# EAGLE design portal2 (EAGLE 5.10)
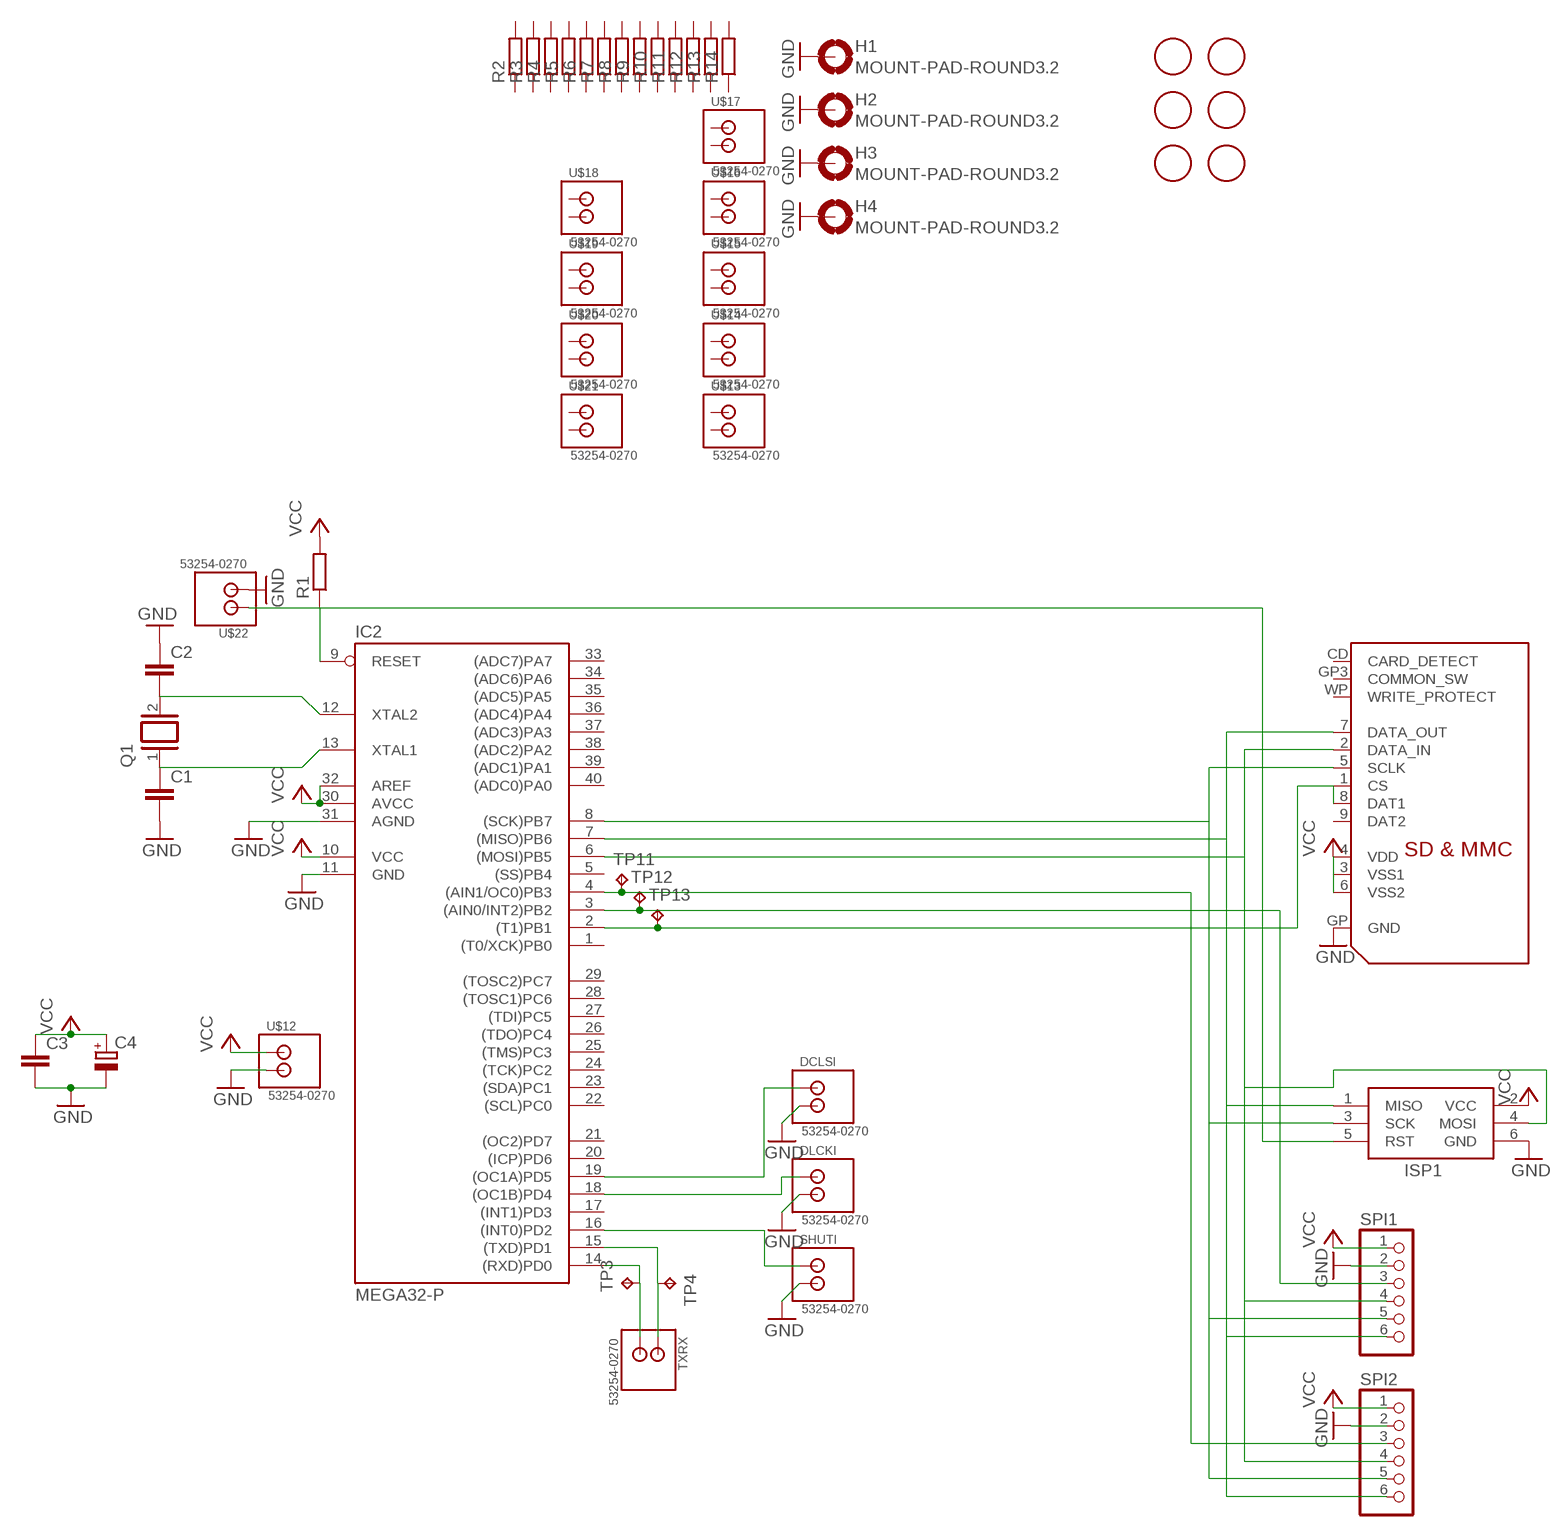
[diagram p0: schematic, sheet 1]

## Parts
C1  C-EU025-025X050  [C025-025X050]
C2  C-EU025-025X050  [C025-025X050]
C3  C-EU025-025X050  [C025-025X050]
C4  CPOL-EUE2,5-6E  [E2,5-6E]
DCLSI  53254-0270  [53254-0270]
DLCKI  53254-0270  [53254-0270]
H1  MOUNT-PAD-ROUND3.2  [3,2-PAD]
H2  MOUNT-PAD-ROUND3.2  [3,2-PAD]
H3  MOUNT-PAD-ROUND3.2  [3,2-PAD]
H4  MOUNT-PAD-ROUND3.2  [3,2-PAD]
IC2  MEGA32-P  [DIL40]
ISP1  AVRISP-6  [AVRISP]
Q1  XTAL/S  [QS]
R1  R-EU_0207/10  [0207/10]
R2  R-EU_0207/10  [0207/10]
R3  R-EU_0207/10  [0207/10]
R4  R-EU_0207/10  [0207/10]
R5  R-EU_0207/10  [0207/10]
R6  R-EU_0207/10  [0207/10]
R7  R-EU_0207/10  [0207/10]
R8  R-EU_0207/10  [0207/10]
R9  R-EU_0207/10  [0207/10]
R10  R-EU_0207/10  [0207/10]
R11  R-EU_0207/10  [0207/10]
R12  R-EU_0207/10  [0207/10]
R13  R-EU_0207/10  [0207/10]
R14  R-EU_0207/10  [0207/10]
SHUTI  53254-0270  [53254-0270]
SPI1  PINHD-1X6  [1X06]
SPI2  PINHD-1X6  [1X06]
TP3  TPB1,27  [B1,27]
TP4  TPB1,27  [B1,27]
TP11  TPB1,27  [B1,27]
TP12  TPB1,27  [B1,27]
TP13  TPB1,27  [B1,27]
TXRX  53254-0270  [53254-0270]
U$1  SDMMC06132  [06132]
U$2  FIDUCIAL  [FIDUCIAL_1MM]
U$3  FIDUCIAL  [FIDUCIAL_1MM]
U$4  FIDUCIAL  [FIDUCIAL_1MM]
U$5  FIDUCIAL  [FIDUCIAL_1MM]
U$6  FIDUCIAL  [FIDUCIAL_1MM]
U$7  FIDUCIAL  [FIDUCIAL_1MM]
U$12  53254-0270  [53254-0270]
U$13  53254-0270  [53254-0270]
U$14  53254-0270  [53254-0270]
U$15  53254-0270  [53254-0270]
U$16  53254-0270  [53254-0270]
U$17  53254-0270  [53254-0270]
U$18  53254-0270  [53254-0270]
U$19  53254-0270  [53254-0270]
U$20  53254-0270  [53254-0270]
U$21  53254-0270  [53254-0270]
U$22  53254-0270  [53254-0270]

## Nets
GND: C1.2 C2.1 C3.2 C4.- DCLSI.P$2 DLCKI.P$2 H1.B3,2(MOUNT) H2.B3,2(MOUNT) H3.B3,2(MOUNT) H4.B3,2(MOUNT) IC2.11(GND) IC2.31(AGND) ISP1.6(GND) SHUTI.P$2 SPI1.2 SPI2.2 U$1.GP(GND) U$12.P$2 U$22.P$2
N$1: C1.1 IC2.13(XTAL1) Q1.1
N$2: C2.2 IC2.12(XTAL2) Q1.2
N$3: IC2.8((SCK)PB7) ISP1.3(SCK) SPI1.5 SPI2.5 U$1.5(SCLK)
N$4: IC2.15((TXD)PD1) TP4.TP TXRX.P$1
N$5: IC2.14((RXD)PD0) TP3.TP TXRX.P$2
N$6: IC2.7((MISO)PB6) ISP1.1(MISO) SPI1.6 SPI2.6 U$1.7(DATA_OUT)
N$7: IC2.16((INT0)PD2) SHUTI.P$1
N$8: DLCKI.P$1 IC2.18((OC1B)PD4)
N$9: IC2.6((MOSI)PB5) ISP1.4(MOSI) SPI1.4 SPI2.4 U$1.2(DATA_IN)
N$10: DCLSI.P$1 IC2.19((OC1A)PD5)
N$14: IC2.4((AIN1/OC0)PB3) SPI2.3 TP11.TP
N$15: IC2.3((AIN0/INT2)PB2) SPI1.3 TP12.TP
N$16: IC2.2((T1)PB1) TP13.TP U$1.1(CS) U$1.8(DAT1)
RESET: IC2.9(RESET) ISP1.5(RST) R1.1 U$22.P$1
VCC: C3.1 C4.+ IC2.10(VCC) IC2.30(AVCC) IC2.32(AREF) ISP1.2(VCC) R1.2 SPI1.1 SPI2.1 U$1.4(VDD) U$1.6(VSS2) U$12.P$1
Unconnected: IC2.1((T0/XCK)PB0) IC2.5((SS)PB4) IC2.17((INT1)PD3) IC2.20((ICP)PD6) IC2.21((OC2)PD7) IC2.22((SCL)PC0) IC2.23((SDA)PC1) IC2.24((TCK)PC2) IC2.25((TMS)PC3) IC2.26((TDO)PC4) IC2.27((TDI)PC5) IC2.28((TOSC1)PC6) IC2.29((TOSC2)PC7) IC2.33((ADC7)PA7) IC2.34((ADC6)PA6) IC2.35((ADC5)PA5) IC2.36((ADC4)PA4) IC2.37((ADC3)PA3) IC2.38((ADC2)PA2) IC2.39((ADC1)PA1) IC2.40((ADC0)PA0) R2.1 R2.2 R3.1 R3.2 R4.1 R4.2 R5.1 R5.2 R6.1 R6.2 R7.1 R7.2 R8.1 R8.2 R9.1 R9.2 R10.1 R10.2 R11.1 R11.2 R12.1 R12.2 R13.1 R13.2 R14.1 R14.2 U$1.3(VSS1) U$1.9(DAT2) U$1.CD(CARD_DETECT) U$1.GP3(COMMON_SW) U$1.WP(WRITE_PROTECT) U$13.P$1 U$13.P$2 U$14.P$1 U$14.P$2 U$15.P$1 U$15.P$2 U$16.P$1 U$16.P$2 U$17.P$1 U$17.P$2 U$18.P$1 U$18.P$2 U$19.P$1 U$19.P$2 U$20.P$1 U$20.P$2 U$21.P$1 U$21.P$2

## Library data of the parts
C1-C3 = rcl:C-EU: CAPACITOR, European symbol
C4 = rcl:CPOL-EU: POLARIZED CAPACITOR, European symbol
DCLSI DLCKI SHUTI TXRX U$12-U$22 = shack1:53254-0270
H1-H4 = holes:MOUNT-PAD-ROUND: MOUNTING PAD, round
IC2 = avr:MEGA32-P: MICROCONTROLLER 32 Kbytes FLASH 2 Kbytes SRAM 1 Kbytes EEPROM USART 8-channel 10 bit ADC
ISP1 = adafruit:AVRISP: AVR ISP HEADER Standard 6 pin header for AVR programming
Q1 = special:XTAL/S: CRYSTAL
R1-R14 = rcl:R-EU_: RESISTOR, European symbol
SPI1 SPI2 = adafruit:PINHD-1X6: PIN HEADER
TP3 TP4 TP11-TP13 = testpad:TP: Test pad
U$1 = adafruit:SDMMC: SD MMC Card holder 4UCON part #06132 - easy to solder
U$2-U$7 = adafruit:FIDUCIAL: For use by pick and place machines to calibrate the vision/machine, 1mm By microbuilder.eu

## Board
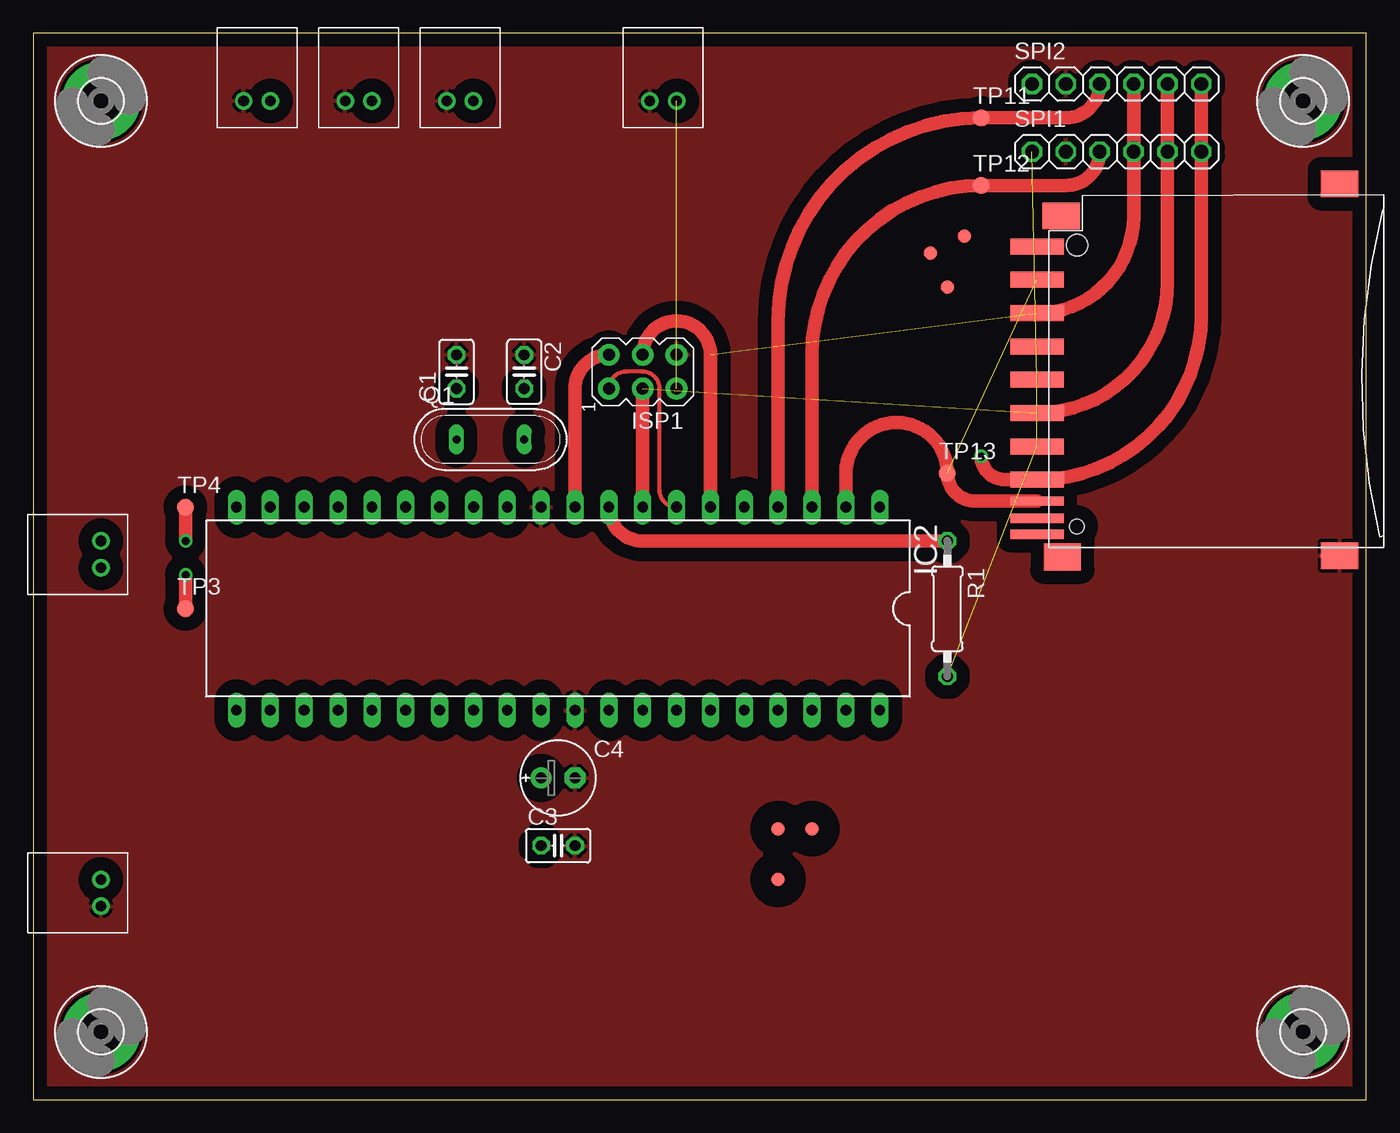
[diagram p1: board, top side]
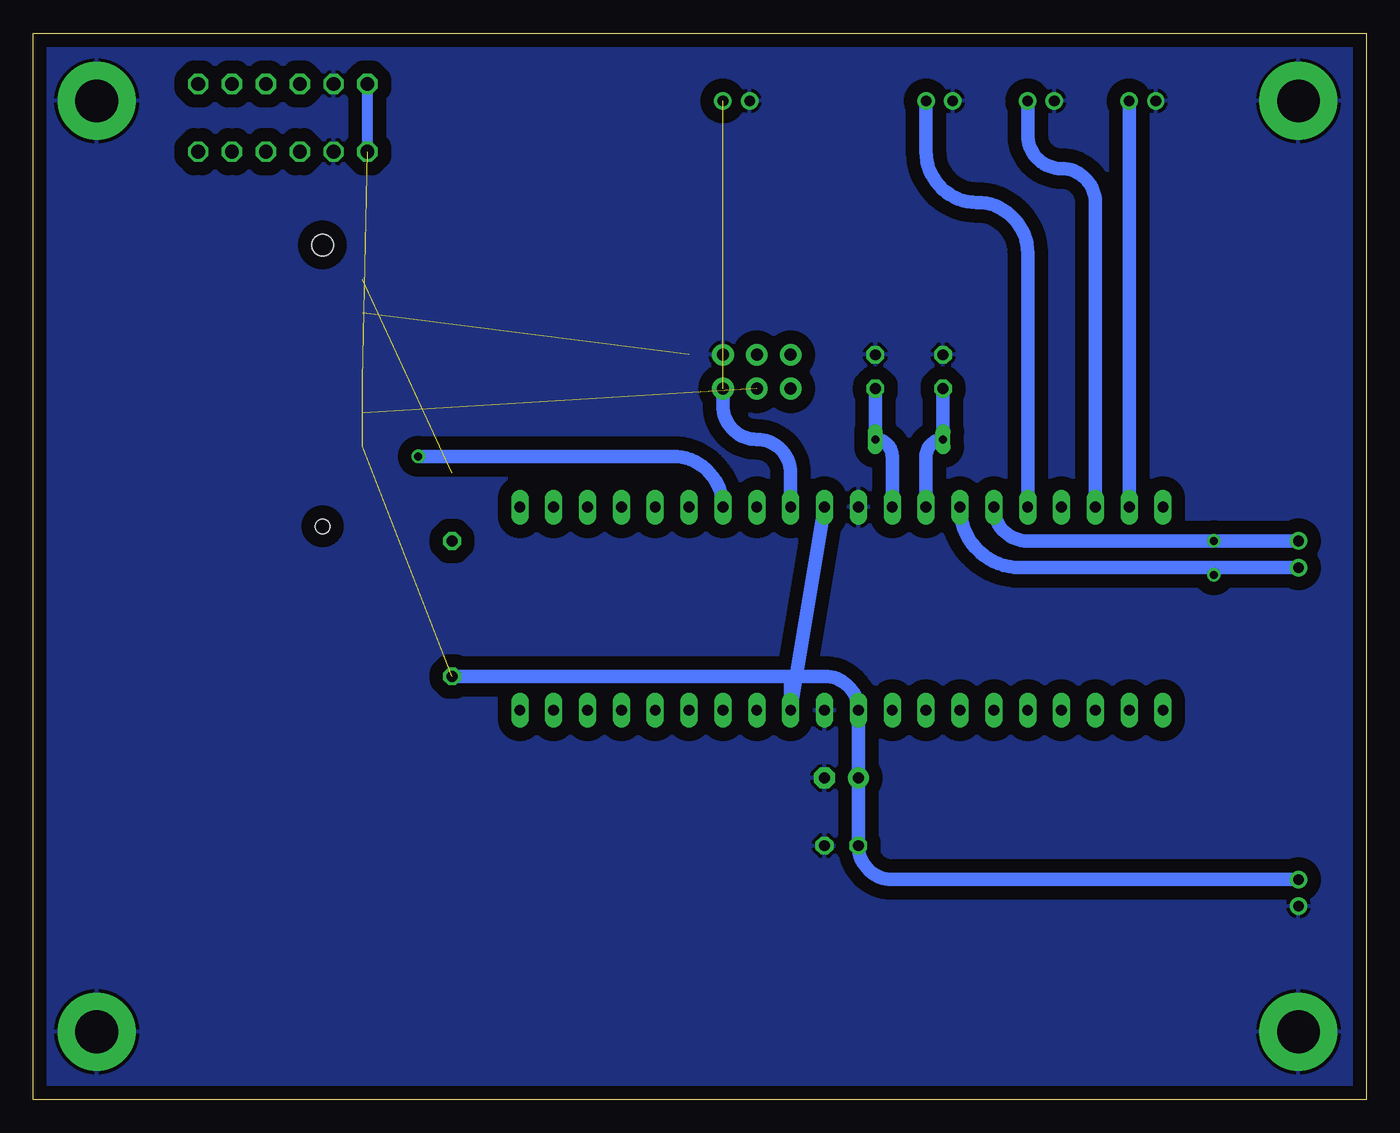
[diagram p2: board, bottom side, seen from below]

Size 100 x 80 mm. Coordinates in mm from the lower left corner, seen from the top.
Outline: 0,0 100,0 100,80 0,80 0,0
Copper layers (1*16): Top 0.035mm / dielectric 1.5mm / Bottom 0.035mm
Design rules "default": minimum track width 10mil, minimum drill 24mil, track to track 8mil, track to pad 8mil, pad to pad 8mil, via to via 8mil, smd to smd 8mil, copper to edge 40mil, drill to drill 8mil, minimum pad ring 10mil, minimum via ring 8mil, stop-mask expansion 4mil, vias tented up to drill 0mil, thermal gap 10mil

### Footprints (pad centres in the part's own frame; a part is rotated, then mirrored left to right if it is on the bottom)
C025-025X050 = drill 0.813 octagon: 1 -1.27,0; 2 1.27,0
E2,5-6E = drill 0.813 pad 1.575 round: + -1.27,0 | drill 0.813 pad 1.575 octagon: - 1.27,0
53254-0270 = drill 0.8 round: P$1 0,0; P$2 0,2
3,2-PAD = drill 3.2 pad 5.842 round: B3,2 0,0
DIL40 = drill 0.813 long: 1 -24.13,-7.62; 2 -21.59,-7.62; 3 -19.05,-7.62; 4 -16.51,-7.62; 5 -13.97,-7.62; 6 -11.43,-7.62; 7 -8.89,-7.62; 8 -6.35,-7.62; 9 -3.81,-7.62; 10 -1.27,-7.62; 11 1.27,-7.62; 12 3.81,-7.62; 13 6.35,-7.62; 14 8.89,-7.62; 15 11.43,-7.62; 16 13.97,-7.62; 17 16.51,-7.62; 18 19.05,-7.62; 19 21.59,-7.62; 20 24.13,-7.62; 21 24.13,7.62; 22 21.59,7.62; 23 19.05,7.62; 24 16.51,7.62; 25 13.97,7.62; 26 11.43,7.62; 27 8.89,7.62; 28 6.35,7.62; 29 3.81,7.62; 30 1.27,7.62; 31 -1.27,7.62; 32 -3.81,7.62; 33 -6.35,7.62; 34 -8.89,7.62; 35 -11.43,7.62; 36 -13.97,7.62; 37 -16.51,7.62; 38 -19.05,7.62; 39 -21.59,7.62; 40 -24.13,7.62
AVRISP = drill 0.9 pad 1.626 round: 1 -1.27,2.54; 2 1.27,2.54; 3 -1.27,0; 4 1.27,0; 5 -1.27,-2.54; 6 1.27,-2.54
QS = drill 0.61 long: 1 -2.54,0; 2 2.54,0
0207/10 = drill 0.813 octagon: 1 -5.08,0; 2 5.08,0
1X06 = drill 1.016 octagon: 1 -6.35,0; 2 -3.81,0; 3 -1.27,0; 4 1.27,0; 5 3.81,0; 6 6.35,0
B1,27 = smd 1.27 x 1.27: TP 0,0
06132 = smd 1.2 x 4: 1 6.9,0.9; 2 4.4,0.9; 3 1.9,0.9; 4 -0.6,0.9; 5 -3.1,0.9; 6 -5.6,0.9; 7 -8.1,0.9; 9 9.4,0.9 | smd 0.7 x 4: 8 -9.7,0.9; CD -11,0.9; WP -12.2,0.9 | smd 2 x 2.8: GP -13.8,-21.8; GP2 14.1,-21.8; GP3 11.7,-0.9; GP4 -13.9,-1 | hole 1.1: -11.6,-2.1 | hole 1.6: 9.5,-2.1
FIDUCIAL_1MM = smd 1 x 1: 1 0,0

### Placement (x,y rotation side)
C1  31.75,54.61 90 top
C2  36.83,54.61 270 top
C3  39.37,19.05 0 top
C4  39.37,24.13 0 top
DCLSI  17.78,74.93 90 top
DLCKI  25.4,74.93 90 top
H1  95.25,5.08 0 top
H2  95.25,74.93 0 top
H3  5.08,74.93 0 top
H4  5.08,5.08 0 top
IC2  39.37,36.83 180 top
ISP1  45.72,54.61 90 top
Q1  34.29,49.53 0 top
R1  68.58,36.83 270 top
R2  -68.58,99.06 0 top  (outside the outline)
R3  -81.28,99.06 0 top  (outside the outline)
R4  -19.05,104.14 0 top  (outside the outline)
R5  -31.75,104.14 0 top  (outside the outline)
R6  -44.45,104.14 0 top  (outside the outline)
R7  -57.15,104.14 0 top  (outside the outline)
R8  -69.85,104.14 0 top  (outside the outline)
R9  -82.55,104.14 0 top  (outside the outline)
R10  -19.05,109.22 0 top  (outside the outline)
R11  -31.75,109.22 0 top  (outside the outline)
R12  -44.45,109.22 0 top  (outside the outline)
R13  -57.15,109.22 0 top  (outside the outline)
R14  -69.85,109.22 0 top  (outside the outline)
SHUTI  33.02,74.93 90 top
SPI1  81.28,71.12 0 top
SPI2  81.28,76.2 0 top
TP3  11.43,36.83 0 top
TP4  11.43,44.45 0 top
TP11  71.12,73.66 0 top
TP12  71.12,68.58 0 top
TP13  68.58,46.99 0 top
TXRX  5.08,41.91 180 top
U$1  76.2,54.61 90 top
U$2  58.42,20.32 0 top
U$3  55.88,20.32 0 top
U$4  55.88,16.51 0 top
U$5  68.58,60.96 0 top
U$6  67.31,63.5 0 top
U$7  69.85,64.77 0 top
U$12  5.08,16.51 180 top
U$13  -86.36,-43.18 0 top  (outside the outline)
U$14  -86.36,-50.8 0 top  (outside the outline)
U$15  -86.36,-58.42 0 top  (outside the outline)
U$16  -86.36,-66.04 0 top  (outside the outline)
U$17  -86.36,-73.66 0 top  (outside the outline)
U$18  -86.36,-81.28 0 top  (outside the outline)
U$19  -86.36,-88.9 0 top  (outside the outline)
U$20  -86.36,-96.52 0 top  (outside the outline)
U$21  -86.36,-104.14 0 top  (outside the outline)
U$22  48.26,74.93 90 top

### Tracks (layer width: path | path; a pad name or v marks a point on that pad's centre or on a via)
GND
  pour Top (isolate 1.016): -1.27,81.28 101.6,81.28 101.6,-1.27 -1.27,-1.27
  pour Bottom (isolate 1.016): -1.27,81.28 101.6,81.28 101.6,-1.27 -1.27,-1.27
N$1
  Bottom 1.016: C1.1 Q1.1 arc-90 33.02,48.26 IC2.13
N$2
  Bottom 1.016: C2.2 Q1.2 arc90 35.56,48.26 IC2.12
N$3  (1 unrouted)
  Top 1.016: U$1.5 arc90 85.09,61.3 SPI1.5 SPI2.5 | IC2.8 ISP1.3
N$4  (via drill 0.6)
  Top 1.016: v11.43,41.91 TP4.TP
  Bottom 1.016: IC2.15 arc-90 25.4,41.91 v11.43,41.91 TXRX.P$1
N$5  (via drill 0.6)
  Top 1.016: v11.43,39.37 TP3.TP
  Bottom 1.016: IC2.14 arc-90 25.94,39.91 10.89,39.91 | TXRX.P$2 10.89,39.91 | 10.89,39.91 arc-90 v11.43,39.37
N$6  (via drill 0.6)
  Top 0.305: IC2.7 arc-90 46.99,45.72 46.99,53.34 arc90 45.72,54.61 44.45,54.61 arc90 ISP1.1
  Top 1.016: SPI2.6 SPI1.6 87.63,58.84 arc-90 U$1.7 72.87,46.51 arc-90 v71.12,48.26
  Bottom 1.016: v71.12,48.26 52.07,48.26 arc90 IC2.7
N$7
  Bottom 1.016: IC2.16 25.4,63.5 arc-90 29.21,67.31 arc90 33.02,71.12 SHUTI.P$1
N$8
  Bottom 1.016: IC2.18 20.32,67.31 arc-90 22.86,69.85 arc90 25.4,72.39 DLCKI.P$1
N$9  (1 unrouted)
  Top 1.016: U$1.2 arc90 82.55,66.26 SPI1.4 SPI2.4 | ISP1.4 arc-90 48.26,58.42 arc-90 50.8,55.88 IC2.6
N$10
  Bottom 1.016: IC2.19 DCLSI.P$1
N$14
  Top 1.016: IC2.4 55.88,58.42 arc-90 TP11.TP 77.47,73.66 arc90 SPI2.3
N$15
  Top 1.016: IC2.3 58.42,55.88 arc-90 TP12.TP 77.47,68.58 arc90 SPI1.3
N$16  (1 unrouted)
  Top 1.016: U$1.8 70.66,44.91 arc-90 TP13.TP arc180 60.96,46.99 IC2.2
RESET  (1 unrouted)
  Top 1.016: R1.1 45.72,41.91 arc-90 IC2.9
  Bottom 1.016: ISP1.5 48.26,52.07 arc-90 45.72,49.53 arc90 43.18,46.99 IC2.9
VCC  (3 unrouted)
  Top 1.016: IC2.10 40.64,53.34 arc-90 ISP1.2
  Bottom 0.813: SPI1.1 SPI2.1
  Bottom 1.016: IC2.10 IC2.32 43.18,31.75 | 43.18,31.75 40.64,31.75 arc90 IC2.30 C4.+ C3.1 arc-90 35.56,16.51 U$12.P$1 | 43.18,31.75 R1.2